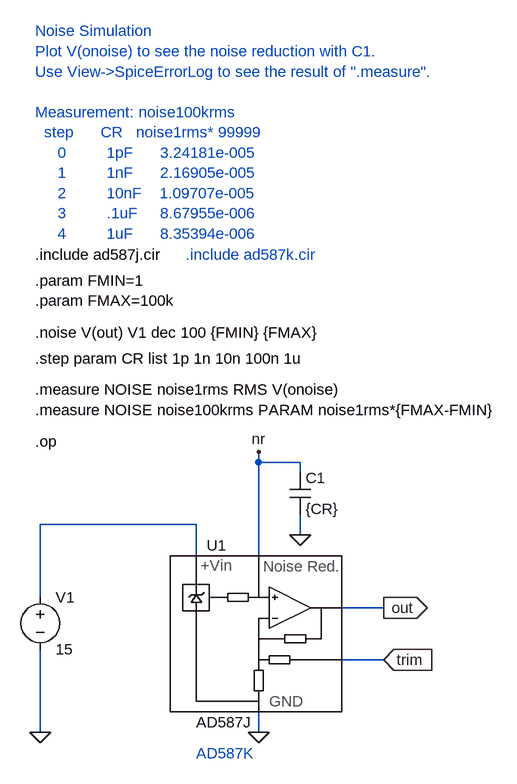
[diagram p0: schematic AD587_test.asc]
AD587_test.asc, the LTspice schematic file:
Version 4
SHEET 1 1224 680
WIRE -112 144 -112 32
WIRE -112 352 -112 224
WIRE 128 32 -112 32
WIRE 128 80 128 32
WIRE 224 -64 224 -80
WIRE 224 80 224 -64
WIRE 224 352 224 320
WIRE 288 -64 224 -64
WIRE 288 -48 288 -64
WIRE 288 48 288 16
WIRE 416 160 352 160
WIRE 416 240 352 240
FLAG -112 352 0
FLAG 224 352 0
FLAG 416 160 out
IOPIN 416 160 Out
FLAG 288 48 0
FLAG 416 240 trim
IOPIN 416 240 In
FLAG 224 -80 nr
SYMBOL voltage -112 128 R0
WINDOW 123 0 0 Left 0
WINDOW 39 0 0 Left 0
SYMATTR InstName V1
SYMATTR Value 15
SYMBOL AD587 128 80 R0
SYMATTR InstName U1
SYMBOL cap 272 -48 R0
SYMATTR InstName C1
SYMATTR Value {CR}
TEXT -120 -384 Left 0 !.include ad587j.cir
TEXT -120 -96 Left 0 !.op
TEXT -120 -224 Left 0 !.step param CR list 1p 1n 10n 100n 1u
TEXT -120 -264 Left 0 !.noise V(out) V1 dec 100 {FMIN} {FMAX}
TEXT -120 -176 Left 0 !.measure NOISE noise1rms RMS V(onoise)\n.measure NOISE noise100krms PARAM noise1rms*{FMAX-FMIN}
TEXT -120 -344 Left 0 !.param FMIN=1\n.param FMAX=100k
TEXT -120 -728 Left 0 ;Noise Simulation \nPlot V(onoise) to see the noise reduction with C1.\nUse View->SpiceErrorLog to see the result of ".measure".\n \nMeasurement: noise100krms\n  step      CR   noise1rms* 99999\n     0         1pF      3.24181e-005\n     1         1nF      2.16905e-005\n     2         10nF    1.09707e-005\n     3         .1uF     8.67955e-006\n     4         1uF      8.35394e-006
TEXT 112 -384 Left 0 ;.include ad587k.cir
TEXT 128 384 Left 0 ;AD587K

The netlist it stands for:
* AD587_test.asc
V1 N001 0 15
XU1 N001 0 trim out nr AD587J  ; pins V+ GND TRIM OUT NR
C1 nr 0 {CR}
.include ad587j.cir
.op
.step param CR list 1p 1n 10n 100n 1u
.noise V(out) V1 dec 100 {FMIN} {FMAX}
.measure NOISE noise1rms RMS V(onoise)
.measure NOISE noise100krms PARAM noise1rms*{FMAX-FMIN}
.param FMIN=1
.param FMAX=100k
* Noise Simulation
* Plot V(onoise) to see the noise reduction with C1.
* Use View->SpiceErrorLog to see the result of ".measure".
* Measurement: noise100krms
*   step      CR   noise1rms* 99999
*      0         1pF      3.24181e-005
*      1         1nF      2.16905e-005
*      2         10nF    1.09707e-005
*      3         .1uF     8.67955e-006
*      4         1uF      8.35394e-006
* .include ad587k.cir
* AD587K
.backanno
.end